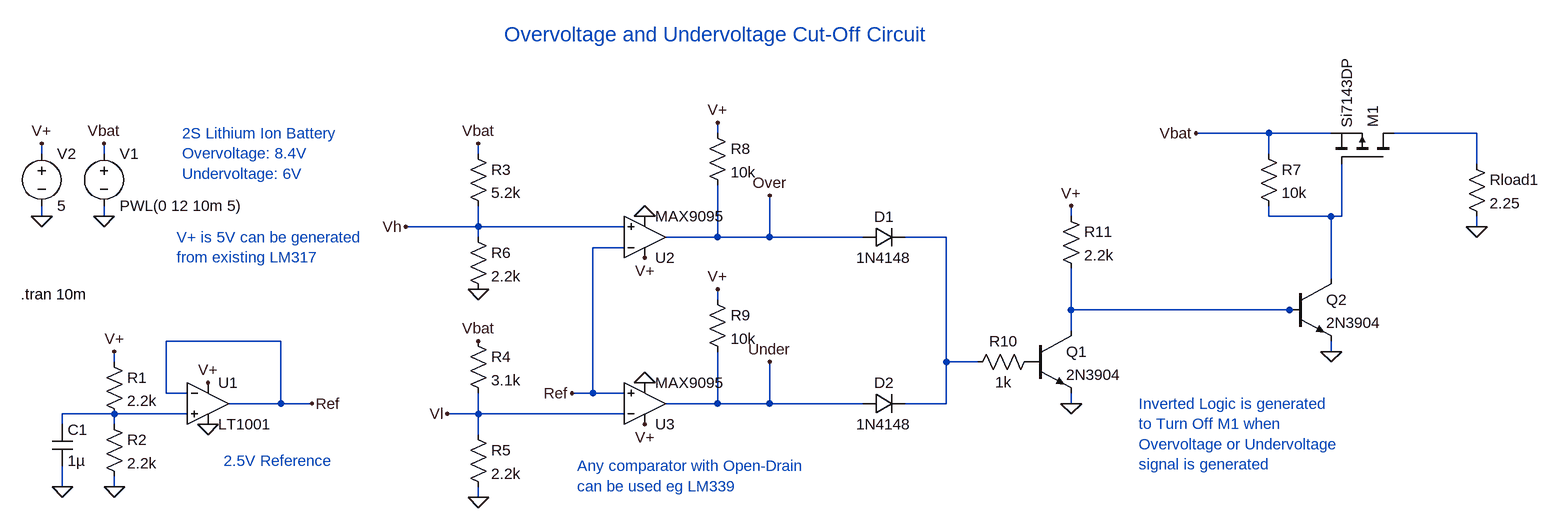
[diagram p0: schematic UV and OV1.asc]
UV and OV1.asc, the LTspice schematic file:
Version 4
SHEET 1 1304 680
WIRE 32 -128 32 -144
WIRE 880 -128 768 -128
WIRE 976 -128 880 -128
WIRE 1200 -128 1072 -128
WIRE -1008 -96 -1008 -112
WIRE -912 -96 -912 -112
WIRE -336 -96 -336 -112
WIRE 880 -96 880 -128
WIRE 1200 -80 1200 -128
WIRE -1008 0 -1008 -16
WIRE -912 0 -912 -16
WIRE 576 0 576 -16
WIRE 880 0 880 -16
WIRE 976 0 880 0
WIRE 992 0 992 -80
WIRE 992 0 976 0
WIRE -336 16 -336 -16
WIRE -336 16 -448 16
WIRE -112 16 -336 16
WIRE 1200 16 1200 0
WIRE -336 32 -336 16
WIRE 32 32 32 -48
WIRE 32 32 -48 32
WIRE 112 32 112 -32
WIRE 112 32 32 32
WIRE 256 32 112 32
WIRE 384 32 320 32
WIRE -112 48 -160 48
WIRE 976 96 976 0
WIRE 32 128 32 112
WIRE 576 144 576 80
WIRE 912 144 576 144
WIRE 928 144 912 144
WIRE 576 176 576 144
WIRE -640 192 -816 192
WIRE 976 208 976 192
WIRE -896 224 -896 208
WIRE 384 224 384 32
WIRE 432 224 384 224
WIRE -816 272 -816 192
WIRE -784 272 -816 272
WIRE -160 272 -160 48
WIRE -160 272 -192 272
WIRE -112 272 -160 272
WIRE -640 288 -640 192
WIRE -640 288 -720 288
WIRE -592 288 -640 288
WIRE 32 288 32 208
WIRE 32 288 -48 288
WIRE 112 288 112 224
WIRE 112 288 32 288
WIRE 256 288 112 288
WIRE 384 288 384 224
WIRE 384 288 320 288
WIRE 576 288 576 272
WIRE -896 304 -976 304
WIRE -784 304 -896 304
WIRE -336 304 -336 272
WIRE -336 304 -384 304
WIRE -112 304 -336 304
WIRE -976 320 -976 304
WIRE -896 320 -896 304
WIRE -336 336 -336 304
WIRE -976 416 -976 384
WIRE -896 416 -896 400
WIRE -336 432 -336 416
FLAG -912 0 0
FLAG -912 -112 Vbat
FLAG -1008 0 0
FLAG -1008 -112 V+
FLAG -80 64 V+
FLAG -80 320 V+
FLAG -80 256 0
FLAG -80 0 0
FLAG -192 272 Ref
FLAG -896 208 V+
FLAG -896 416 0
FLAG -752 256 V+
FLAG -752 320 0
FLAG -976 416 0
FLAG -592 288 Ref
FLAG -336 -112 Vbat
FLAG -336 432 0
FLAG 112 -32 Over
FLAG -448 16 Vh
FLAG -384 304 Vl
FLAG 112 224 Under
FLAG -336 112 0
FLAG -336 192 Vbat
FLAG 768 -128 Vbat
FLAG 1200 16 0
FLAG 32 -144 V+
FLAG 32 112 V+
FLAG 576 288 0
FLAG 576 -16 V+
FLAG 976 208 0
SYMBOL voltage -912 -112 R0
WINDOW 123 0 0 Left 0
WINDOW 39 0 0 Left 0
SYMATTR InstName V1
SYMATTR Value PWL(0 12 10m 5)
SYMBOL voltage -1008 -112 R0
WINDOW 123 0 0 Left 0
WINDOW 39 0 0 Left 0
SYMATTR InstName V2
SYMATTR Value 5
SYMBOL res -912 208 R0
SYMATTR InstName R1
SYMATTR Value 2.2k
SYMBOL res -912 304 R0
SYMATTR InstName R2
SYMATTR Value 2.2k
SYMBOL OpAmps\\LT1001 -752 224 R0
SYMATTR InstName U1
SYMBOL cap -992 320 R0
SYMATTR InstName C1
SYMATTR Value 1µ
SYMBOL res -352 -112 R0
SYMATTR InstName R3
SYMATTR Value 5.2k
SYMBOL res -352 176 R0
SYMATTR InstName R4
SYMATTR Value 3.1k
SYMBOL res -352 320 R0
SYMATTR InstName R5
SYMATTR Value 2.2k
SYMBOL res -352 16 R0
SYMATTR InstName R6
SYMATTR Value 2.2k
SYMBOL res 864 -112 R0
SYMATTR InstName R7
SYMATTR Value 10k
SYMBOL pmos 1072 -80 M270
SYMATTR InstName M1
SYMATTR Value Si7143DP
SYMBOL res 1184 -96 R0
SYMATTR InstName Rload1
SYMATTR Value 2.25
SYMBOL Comparators\\MAX9095 -80 32 M180
SYMATTR InstName U2
SYMBOL Comparators\\MAX9095 -80 288 M180
SYMATTR InstName U3
SYMBOL res 16 -144 R0
SYMATTR InstName R8
SYMATTR Value 10k
SYMBOL res 16 112 R0
SYMATTR InstName R9
SYMATTR Value 10k
SYMBOL npn 512 176 R0
SYMATTR InstName Q1
SYMATTR Value 2N3904
SYMBOL diode 256 48 R270
WINDOW 0 32 32 VTop 2
WINDOW 3 0 32 VBottom 2
SYMATTR InstName D1
SYMATTR Value 1N4148
SYMBOL diode 256 304 R270
WINDOW 0 32 32 VTop 2
WINDOW 3 0 32 VBottom 2
SYMATTR InstName D2
SYMATTR Value 1N4148
SYMBOL res 528 208 R90
WINDOW 0 0 56 VBottom 2
WINDOW 3 32 56 VTop 2
SYMATTR InstName R10
SYMATTR Value 1k
SYMBOL res 560 -16 R0
SYMATTR InstName R11
SYMATTR Value 2.2k
SYMBOL npn 912 96 R0
SYMATTR InstName Q2
SYMATTR Value 2N3904
TEXT -1040 120 Left 2 !.tran 10m
TEXT -792 -128 Left 2 ;2S Lithium Ion Battery\nOvervoltage: 8.4V\nUndervoltage: 6V
TEXT -800 32 Left 2 ;V+ is 5V can be generated \nfrom existing LM317
TEXT -728 376 Left 2 ;2.5V Reference
TEXT -184 384 Left 2 ;Any comparator with Open-Drain \ncan be used eg LM339
TEXT 680 288 Left 2 ;Inverted Logic is generated\nto Turn Off M1 when \nOvervoltage or Undervoltage \nsignal is generated
TEXT -296 -280 Left 3 ;Overvoltage and Undervoltage Cut-Off Circuit

The netlist it stands for:
* UV and OV1.asc
V1 Vbat 0 PWL(0 12 10m 5)
V2 V+ 0 5
R1 V+ N005 2.2k
R2 N005 0 2.2k
XU1 N005 Ref V+ 0 Ref LT1001  ; pins In+ In- V+ V- OUT
C1 N005 0 1µ
R3 Vbat Vh 5.2k
R4 Vbat Vl 3.1k
R5 Vl 0 2.2k
R6 Vh 0 2.2k
R7 Vbat N002 10k
M1 N001 N002 Vbat Vbat Si7143DP
Rload1 N001 0 2.25
* U2: MAX9095 (symbol Comparators\MAX9095 not available, pins judged from their places): In+=Vh In-=Ref V+=V+ V-=0 OUT=Over
* U3: MAX9095 (symbol Comparators\MAX9095 not available, pins judged from their places): In+=Ref In-=Vl V+=V+ V-=0 OUT=Under
R8 V+ Over 10k
R9 V+ Under 10k
Q1 N004 P001 0 0 2N3904
D1 Over N003 1N4148
D2 Under N003 1N4148
R10 P001 N003 1k
R11 V+ N004 2.2k
Q2 N002 N004 0 0 2N3904
.model D D
.lib standard.dio
.model NPN NPN
.model PNP PNP
.lib standard.bjt
.model NMOS NMOS
.model PMOS PMOS
.lib standard.mos
.tran 10m
* 2S Lithium Ion Battery
* Overvoltage: 8.4V
* Undervoltage: 6V
* V+ is 5V can be generated
* from existing LM317
* 2.5V Reference
* Any comparator with Open-Drain
* can be used eg LM339
* Inverted Logic is generated
* to Turn Off M1 when
* Overvoltage or Undervoltage
* signal is generated
* Overvoltage and Undervoltage Cut-Off Circuit
.lib LTC.lib
.backanno
.end